# EAGLE design MCU_Board - Rev A2 (EAGLE 7.7.0)

## Sheet 1 of 2
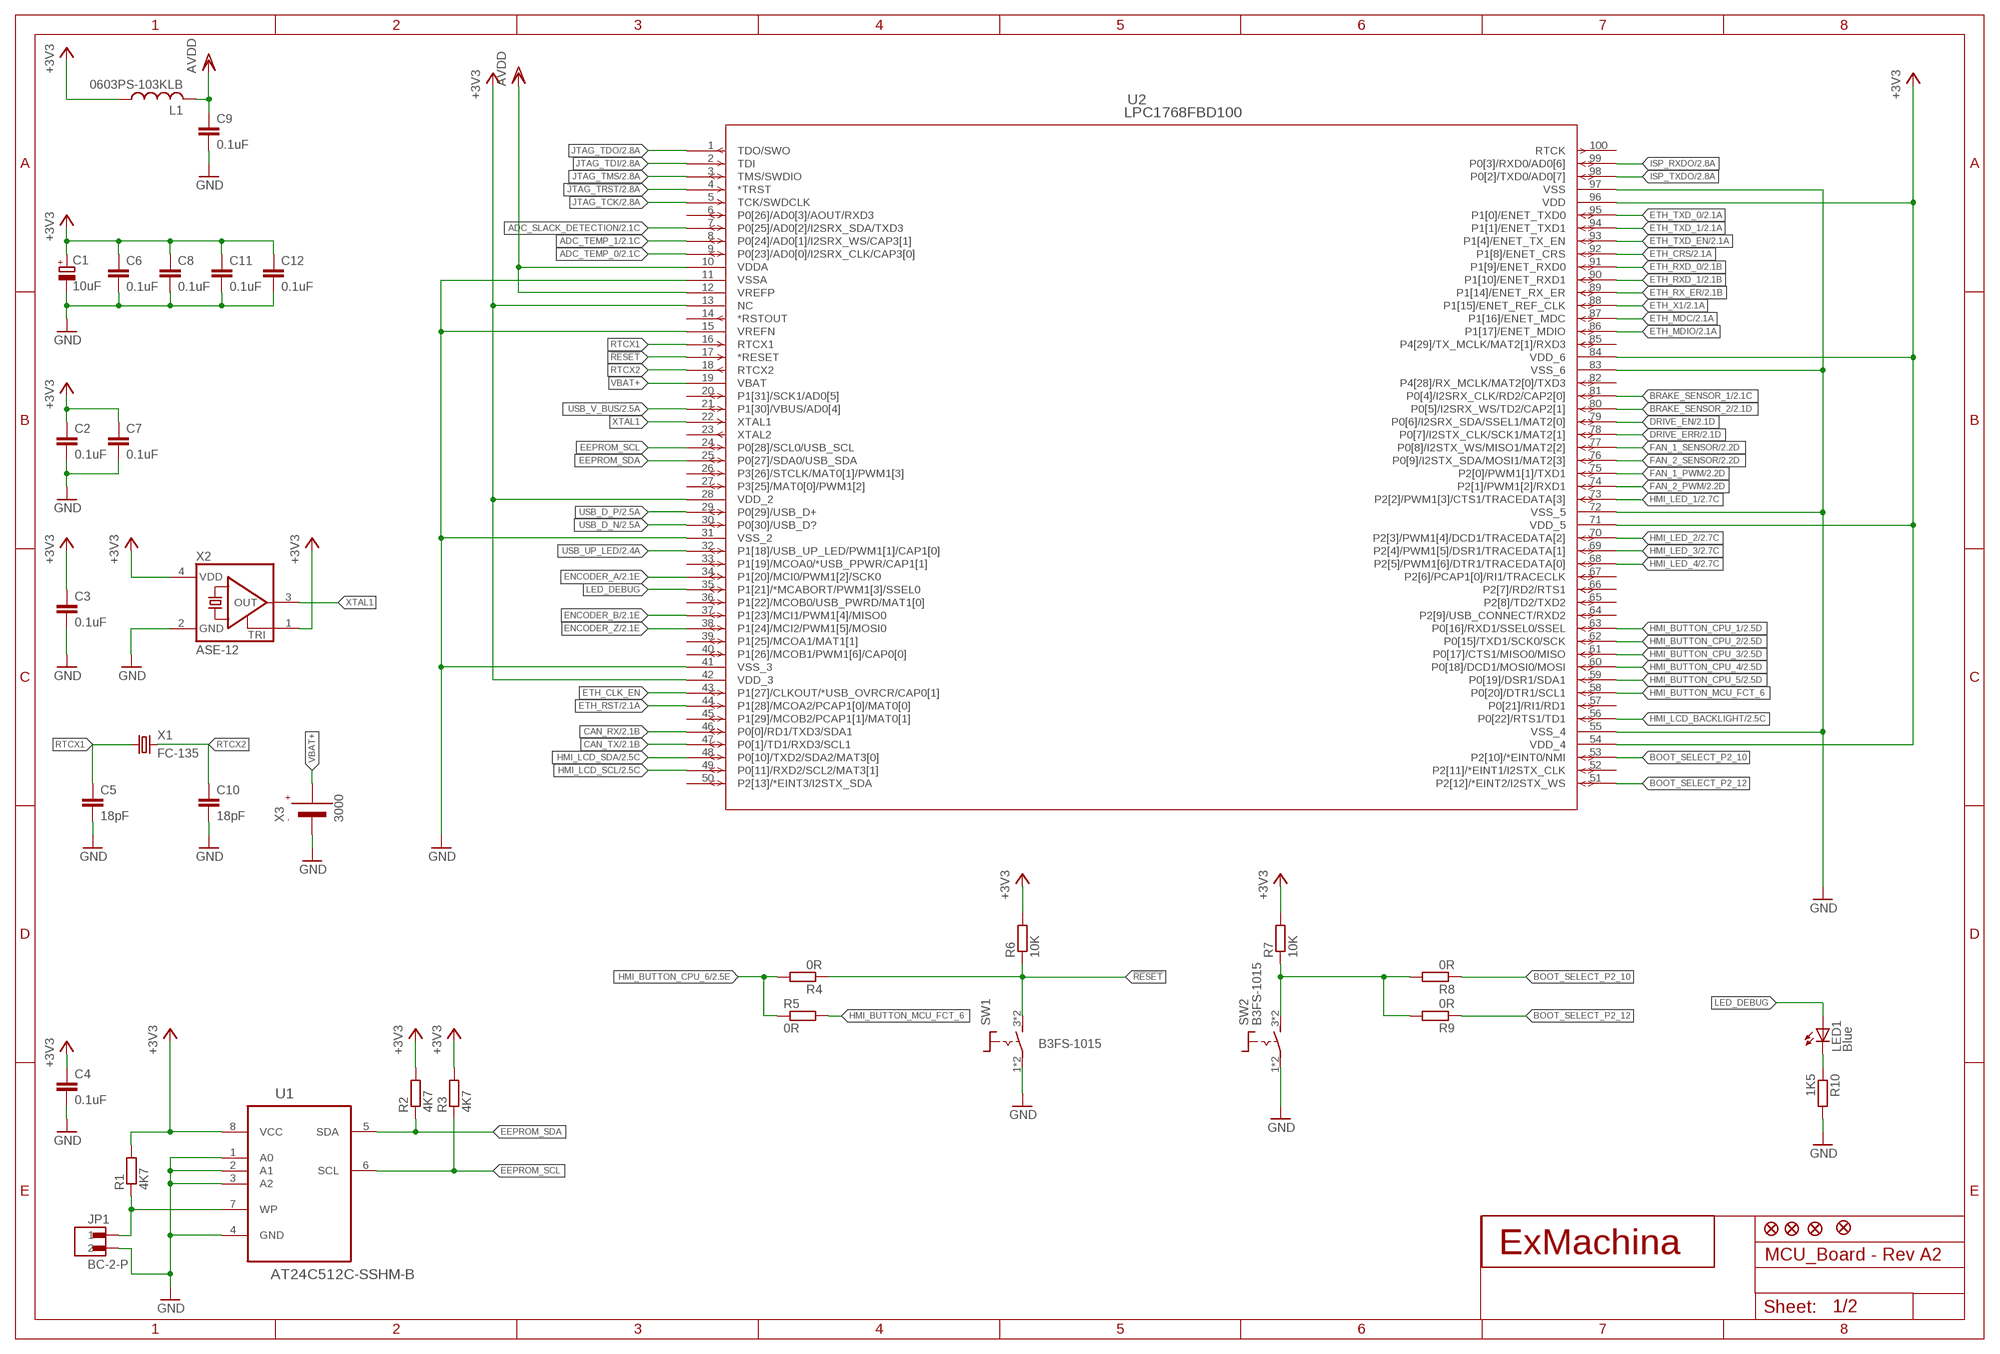
[diagram p0: schematic, sheet 1]

### Parts
C1  10uF  CPOL-EUCT3216  [CT3216]
C2  0.1uF  C-EUC0603  [C0603]
C3  0.1uF  C-EUC0603  [C0603]
C4  0.1uF  C-EUC0603  [C0603]
C5  18pF  C-EUC0603  [C0603]
C6  0.1uF  C-EUC0603  [C0603]
C7  0.1uF  C-EUC0603  [C0603]
C8  0.1uF  C-EUC0603  [C0603]
C9  0.1uF  C-EUC0603  [C0603]
C10  18pF  C-EUC0603  [C0603]
C11  0.1uF  C-EUC0603  [C0603]
C12  0.1uF  C-EUC0603  [C0603]
JP1  BC-2-P  [BC-2-P]
JP2  FIDUCIAL1X2  [FIDUCIAL-1X2]
JP3  FIDUCIAL1X2  [FIDUCIAL-1X2]
JP4  FIDUCIAL1X2  [FIDUCIAL-1X2]
JP5  FIDUCIAL1X2  [FIDUCIAL-1X2]
L1  0603PS-103KLB  0603PS  [0603]
LED1  Blue  LEDCHIPLED_0603  [CHIPLED_0603]
R1  4K7  R-EU_R0603  [R0603]
R2  4K7  R-EU_R0603  [R0603]
R3  4K7  R-EU_R0603  [R0603]
R4  0R  R-EU_R0603  [R0603]
R5  0R  R-EU_R0603  [R0603]
R6  10K  R-EU_R0603  [R0603]
R7  10K  R-EU_R0603  [R0603]
R8  0R  R-EU_R0603  [R0603]
R9  0R  R-EU_R0603  [R0603]
R10  1K5  R-EU_R0603  [R0603]
SW1  B3FS-1015  [B3FS]
SW2  B3FS-1015  [B3FS]
T2  EXMACHINA-LOGO-NAME  [EXM-LOGO-BASELINE]
U1  AT24C512C-SSHM-B  [SOIC127P600X175-8N]
U2  LPC1768FBD100  [SOT407-1]
X1  FC-135  [FC-135]
X2  ASE-12  ASE  [ASE]
X3  3000  [3000]

### Nets
!JTAG_TRST: U2.4(*TRST) ; also sheet 2
!RESET: R4.1 R6.1 SW1.3 SW1.4 U2.17(*RESET)
+3V3 [supply]: C1.+ C2.1 C3.1 C4.1 C6.1 C7.1 C8.1 C11.1 C12.1 L1.P$1 R1.2 R2.2 R3.2 R6.2 R7.2 U1.8(VCC) U2.13(NC) U2.28(VDD_2) U2.42(VDD_3) U2.54(VDD_4) U2.71(VDD_5) U2.84(VDD_6) U2.96(VDD) X2.1(TRI) X2.4(VDD) ; also sheet 2
ADC_SLACK_DETECTION [signal]: U2.7(P0[25]/AD0[2]/I2SRX_SDA/TXD3) ; also sheet 2
ADC_TEMP_0 [signal]: U2.9(P0[23]/AD0[0]/I2SRX_CLK/CAP3[0]) ; also sheet 2
ADC_TEMP_1 [signal]: U2.8(P0[24]/AD0[1]/I2SRX_WS/CAP3[1]) ; also sheet 2
AVDD: C9.1 L1.P$2 U2.10(VDDA) U2.12(VREFP) ; also sheet 2
BOOT_SELECT_P2_10 [signal]: R8.1 U2.53(P2[10]/*EINT0/NMI)
BOOT_SELECT_P2_12 [signal]: R9.1 U2.51(P2[12]/*EINT2/I2STX_WS)
BRAKE_SENSOR_1: U2.81(P0[4]/I2SRX_CLK/RD2/CAP2[0]) ; also sheet 2
BRAKE_SENSOR_2: U2.80(P0[5]/I2SRX_WS/TD2/CAP2[1]) ; also sheet 2
CAN_RX [signal]: U2.46(P0[0]/RD1/TXD3/SDA1) ; also sheet 2
CAN_TX [signal]: U2.47(P0[1]/TD1/RXD3/SCL1) ; also sheet 2
DRIVE_EN: U2.79(P0[6]/I2SRX_SDA/SSEL1/MAT2[0]) ; also sheet 2
DRIVE_ERR: U2.78(P0[7]/I2STX_CLK/SCK1/MAT2[1]) ; also sheet 2
EEPROM_SCL: R3.1 U1.6(SCL) U2.24(P0[28]/SCL0/USB_SCL)
EEPROM_SDA: R2.1 U1.5(SDA) U2.25(P0[27]/SDA0/USB_SDA)
ENCODER_A: U2.34(P1[20]/MCI0/PWM1[2]/SCK0) ; also sheet 2
ENCODER_B: U2.37(P1[23]/MCI1/PWM1[4]/MISO0) ; also sheet 2
ENCODER_Z: U2.38(P1[24]/MCI2/PWM1[5]/MOSI0) ; also sheet 2
ETH_CLK_EN [signal]: U2.43(P1[27]/CLKOUT/*USB_OVRCR/CAP0[1])
ETH_CRS [signal]: U2.92(P1[8]/ENET_CRS) ; also sheet 2
ETH_MDC [signal]: U2.87(P1[16]/ENET_MDC) ; also sheet 2
ETH_MDIO [signal]: U2.86(P1[17]/ENET_MDIO) ; also sheet 2
ETH_RST: U2.44(P1[28]/MCOA2/PCAP1[0]/MAT0[0]) ; also sheet 2
ETH_RX_ER [signal]: U2.89(P1[14]/ENET_RX_ER) ; also sheet 2
ETH_RXD_0 [signal]: U2.91(P1[9]/ENET_RXD0) ; also sheet 2
ETH_RXD_1 [signal]: U2.90(P1[10]/ENET_RXD1) ; also sheet 2
ETH_TXD_0 [signal]: U2.95(P1[0]/ENET_TXD0) ; also sheet 2
ETH_TXD_1 [signal]: U2.94(P1[1]/ENET_TXD1) ; also sheet 2
ETH_TXD_EN [signal]: U2.93(P1[4]/ENET_TX_EN) ; also sheet 2
ETH_X1: U2.88(P1[15]/ENET_REF_CLK) ; also sheet 2
FAN_1_PWM [signal]: U2.75(P2[0]/PWM1[1]/TXD1) ; also sheet 2
FAN_1_SENSOR [signal]: U2.77(P0[8]/I2STX_WS/MISO1/MAT2[2]) ; also sheet 2
FAN_2_PWM [signal]: U2.74(P2[1]/PWM1[2]/RXD1) ; also sheet 2
FAN_2_SENSOR [signal]: U2.76(P0[9]/I2STX_SDA/MOSI1/MAT2[3]) ; also sheet 2
GND [supply]: C1.- C2.2 C3.2 C4.2 C5.2 C6.2 C7.2 C8.2 C9.2 C10.2 C11.2 C12.2 JP1.2 R10.2 SW1.1 SW1.2 SW2.1 SW2.2 U1.1(A0) U1.2(A1) U1.3(A2) U1.4(GND) U2.11(VSSA) U2.15(VREFN) U2.31(VSS_2) U2.41(VSS_3) U2.55(VSS_4) U2.72(VSS_5) U2.83(VSS_6) U2.97(VSS) X2.2(GND) X3.-(VBAT-) ; also sheet 2
HMI_BUTTON_CPU_1: U2.63(P0[16]/RXD1/SSEL0/SSEL) ; also sheet 2
HMI_BUTTON_CPU_2: U2.62(P0[15]/TXD1/SCK0/SCK) ; also sheet 2
HMI_BUTTON_CPU_3: U2.61(P0[17]/CTS1/MISO0/MISO) ; also sheet 2
HMI_BUTTON_CPU_4: U2.60(P0[18]/DCD1/MOSI0/MOSI) ; also sheet 2
HMI_BUTTON_CPU_5: U2.59(P0[19]/DSR1/SDA1) ; also sheet 2
HMI_BUTTON_CPU_6: R4.2 R5.1 ; also sheet 2
HMI_BUTTON_MCU_FCT_6: R5.2 U2.58(P0[20]/DTR1/SCL1)
HMI_LCD_BACKLIGHT: U2.56(P0[22]/RTS1/TD1) ; also sheet 2
HMI_LCD_SCL [signal]: U2.49(P0[11]/RXD2/SCL2/MAT3[1]) ; also sheet 2
HMI_LCD_SDA [signal]: U2.48(P0[10]/TXD2/SDA2/MAT3[0]) ; also sheet 2
HMI_LED_1 [signal]: U2.73(P2[2]/PWM1[3]/CTS1/TRACEDATA[3]) ; also sheet 2
HMI_LED_2 [signal]: U2.70(P2[3]/PWM1[4]/DCD1/TRACEDATA[2]) ; also sheet 2
HMI_LED_3 [signal]: U2.69(P2[4]/PWM1[5]/DSR1/TRACEDATA[1]) ; also sheet 2
HMI_LED_4 [signal]: U2.68(P2[5]/PWM1[6]/DTR1/TRACEDATA[0]) ; also sheet 2
ISP_RXDO [signal]: U2.99(P0[3]/RXD0/AD0[6]) ; also sheet 2
ISP_TXDO [signal]: U2.98(P0[2]/TXD0/AD0[7]) ; also sheet 2
JTAG_TCK [signal]: U2.5(TCK/SWDCLK) ; also sheet 2
JTAG_TDI [signal]: U2.2(TDI) ; also sheet 2
JTAG_TDO [signal]: U2.1(TDO/SWO) ; also sheet 2
JTAG_TMS [signal]: U2.3(TMS/SWDIO) ; also sheet 2
LED_DEBUG [signal]: LED1.A U2.35(P1[21]/*MCABORT/PWM1[3]/SSEL0)
N$5 [signal]: R7.1 R8.2 R9.2 SW2.3 SW2.4
N$22: JP1.1 R1.1 U1.7(WP)
N$29 [signal]: LED1.C R10.1
RTCX1: C5.1 U2.16(RTCX1) X1.1
RTCX2: C10.1 U2.18(RTCX2) X1.2
USB_D_N [signal]: U2.30(P0[30]/USB_D?) ; also sheet 2
USB_D_P [signal]: U2.29(P0[29]/USB_D+) ; also sheet 2
USB_UP_LED [signal]: U2.32(P1[18]/USB_UP_LED/PWM1[1]/CAP1[0]) ; also sheet 2
USB_V_BUS [signal]: U2.21(P1[30]/VBUS/AD0[4]) ; also sheet 2
VBAT+: U2.19(VBAT) X3.+1(VBAT+) X3.+2(VBAT+)
XTAL1: U2.22(XTAL1) X2.3(OUT)
Unconnected: U2.6(P0[26]/AD0[3]/AOUT/RXD3) U2.14(*RSTOUT) U2.20(P1[31]/SCK1/AD0[5]) U2.23(XTAL2) U2.26(P3[26]/STCLK/MAT0[1]/PWM1[3]) U2.27(P3[25]/MAT0[0]/PWM1[2]) U2.33(P1[19]/MCOA0/*USB_PPWR/CAP1[1]) U2.36(P1[22]/MCOB0/USB_PWRD/MAT1[0]) U2.39(P1[25]/MCOA1/MAT1[1]) U2.40(P1[26]/MCOB1/PWM1[6]/CAP0[0]) U2.45(P1[29]/MCOB2/PCAP1[1]/MAT0[1]) U2.50(P2[13]/*EINT3/I2STX_SDA) U2.52(P2[11]/*EINT1/I2STX_CLK) U2.57(P0[21]/RI1/RD1) U2.64(P2[9]/USB_CONNECT/RXD2) U2.65(P2[8]/TD2/TXD2) U2.66(P2[7]/RD2/RTS1) U2.67(P2[6]/PCAP1[0]/RI1/TRACECLK) U2.82(P4[28]/RX_MCLK/MAT2[0]/TXD3) U2.85(P4[29]/TX_MCLK/MAT2[1]/RXD3) U2.100(RTCK)

## Sheet 2 of 2
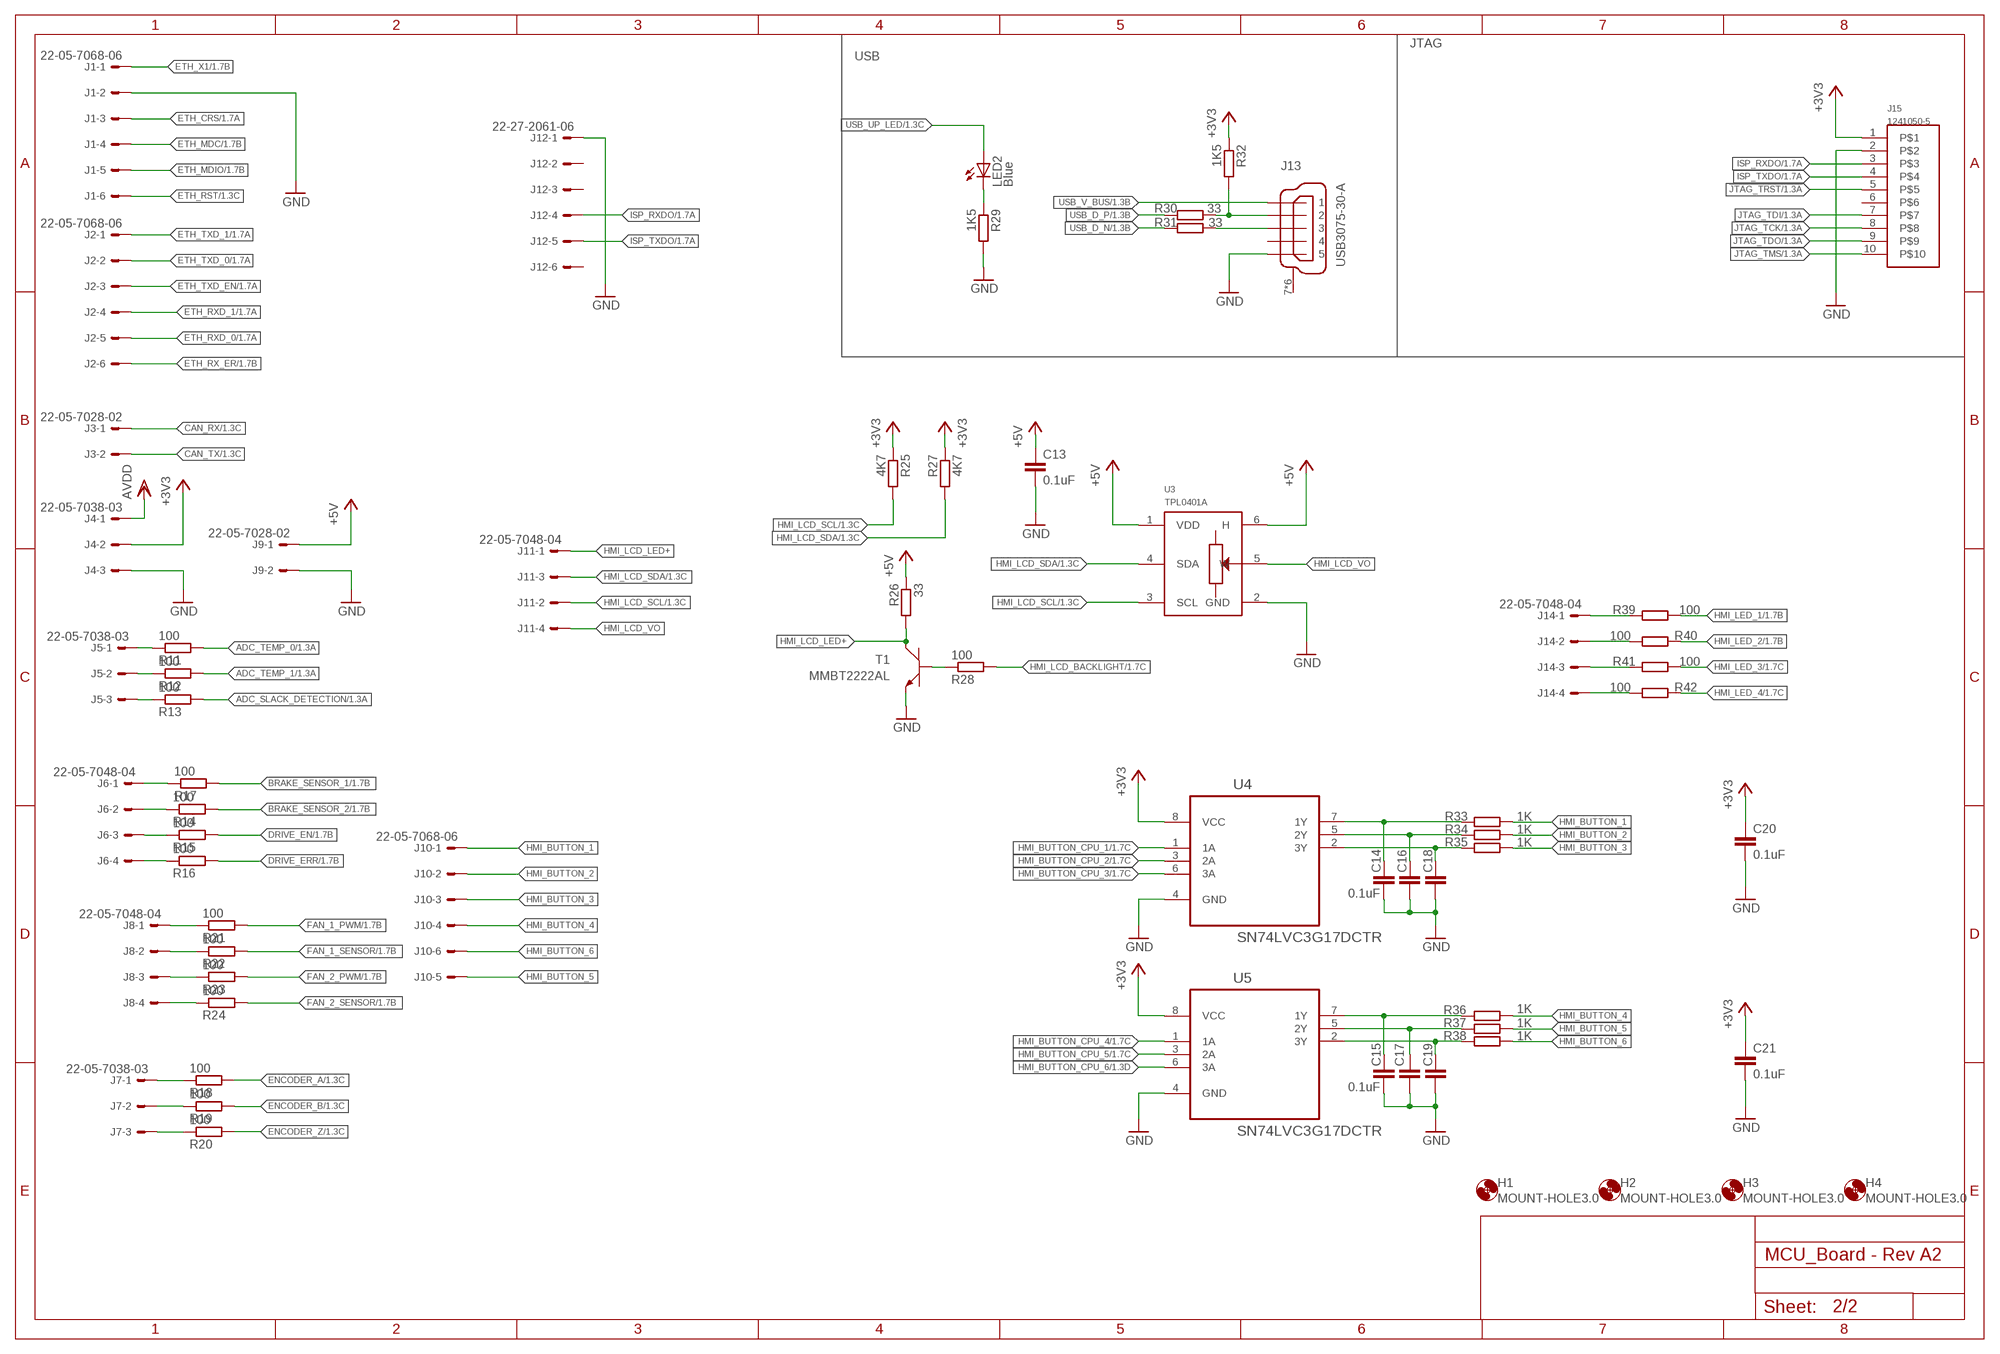
[diagram p1: schematic, sheet 2]

### Parts
C13  0.1uF  C-EUC0603  [C0603]
C14  0.1uF  C-EUC0603  [C0603]
C15  0.1uF  C-EUC0603  [C0603]
C16  0.1uF  C-EUC0603  [C0603]
C17  0.1uF  C-EUC0603  [C0603]
C18  0.1uF  C-EUC0603  [C0603]
C19  0.1uF  C-EUC0603  [C0603]
C20  0.1uF  C-EUC0603  [C0603]
C21  0.1uF  C-EUC0603  [C0603]
H1  MOUNT-HOLE3.0  [3,0]
H2  MOUNT-HOLE3.0  [3,0]
H3  MOUNT-HOLE3.0  [3,0]
H4  MOUNT-HOLE3.0  [3,0]
J1  22-05-7068-06  [7395-06]
J2  22-05-7068-06  [7395-06]
J3  22-05-7028-02  [7395-02]
J4  22-05-7038-03  [7395-03]
J5  22-05-7038-03  [7395-03]
J6  22-05-7048-04  [7395-04]
J7  22-05-7038-03  [7395-03]
J8  22-05-7048-04  [7395-04]
J9  22-05-7028-02  [7395-02]
J10  22-05-7068-06  [7395-06]
J11  22-05-7048-04  [7395-04]
J12  22-27-2061-06  [6410-06]
J13  USB3075-30-A  [USB_MICROB_SMT]
J14  22-05-7048-04  [7395-04]
J15  1241050-5  [2.54/2X5]
LED2  Blue  LEDCHIPLED_0603  [CHIPLED_0603]
R11  100  R-EU_R0603  [R0603]
R12  100  R-EU_R0603  [R0603]
R13  100  R-EU_R0603  [R0603]
R14  100  R-EU_R0603  [R0603]
R15  100  R-EU_R0603  [R0603]
R16  100  R-EU_R0603  [R0603]
R17  100  R-EU_R0603  [R0603]
R18  100  R-EU_R0603  [R0603]
R19  100  R-EU_R0603  [R0603]
R20  100  R-EU_R0603  [R0603]
R21  100  R-EU_R0603  [R0603]
R22  100  R-EU_R0603  [R0603]
R23  100  R-EU_R0603  [R0603]
R24  100  R-EU_R0603  [R0603]
R25  4K7  R-EU_R0603  [R0603]
R26  33  R-EU_R0603  [R0603]
R27  4K7  R-EU_R0603  [R0603]
R28  100  R-EU_R0603  [R0603]
R29  1K5  R-EU_R0603  [R0603]
R30  33  R-EU_R0603  [R0603]
R31  33  R-EU_R0603  [R0603]
R32  1K5  R-EU_R0603  [R0603]
R33  1K  R-EU_R0603  [R0603]
R34  1K  R-EU_R0603  [R0603]
R35  1K  R-EU_R0603  [R0603]
R36  1K  R-EU_R0603  [R0603]
R37  1K  R-EU_R0603  [R0603]
R38  1K  R-EU_R0603  [R0603]
R39  100  R-EU_R0603  [R0603]
R40  100  R-EU_R0603  [R0603]
R41  100  R-EU_R0603  [R0603]
R42  100  R-EU_R0603  [R0603]
T1  MMBT2222AL  [SOT−23]
U3  TPL0401A  [SC-70-DCK]
U4  SN74LVC3G17DCTR  [SOP65P400X130-8N]
U5  SN74LVC3G17DCTR  [SOP65P400X130-8N]

### Nets
!JTAG_TRST: J15.5 ; also sheet 1
+3V3 [supply]: C20.1 C21.1 J4.2 J15.1 R25.1 R27.1 R32.1 U4.8(VCC) U5.8(VCC) ; also sheet 1
+5V [supply]: C13.1 J9.1 R26.1 U3.1(VDD) U3.6(H)
ADC_SLACK_DETECTION [signal]: R13.2 ; also sheet 1
ADC_TEMP_0 [signal]: R11.2 ; also sheet 1
ADC_TEMP_1 [signal]: R12.2 ; also sheet 1
AVDD: J4.1 ; also sheet 1
BRAKE_SENSOR_1: R17.2 ; also sheet 1
BRAKE_SENSOR_2: R14.2 ; also sheet 1
CAN_RX [signal]: J3.1 ; also sheet 1
CAN_TX [signal]: J3.2 ; also sheet 1
DRIVE_EN: R15.2 ; also sheet 1
DRIVE_ERR: R16.2 ; also sheet 1
ENCODER_A: R18.2 ; also sheet 1
ENCODER_B: R19.2 ; also sheet 1
ENCODER_Z: R20.2 ; also sheet 1
ETH_CRS [signal]: J1.3 ; also sheet 1
ETH_MDC [signal]: J1.4 ; also sheet 1
ETH_MDIO [signal]: J1.5 ; also sheet 1
ETH_RST: J1.6 ; also sheet 1
ETH_RX_ER [signal]: J2.6 ; also sheet 1
ETH_RXD_0 [signal]: J2.5 ; also sheet 1
ETH_RXD_1 [signal]: J2.4 ; also sheet 1
ETH_TXD_0 [signal]: J2.2 ; also sheet 1
ETH_TXD_1 [signal]: J2.1 ; also sheet 1
ETH_TXD_EN [signal]: J2.3 ; also sheet 1
ETH_X1: J1.1 ; also sheet 1
FAN_1_PWM [signal]: R21.2 ; also sheet 1
FAN_1_SENSOR [signal]: R22.2 ; also sheet 1
FAN_2_PWM [signal]: R23.2 ; also sheet 1
FAN_2_SENSOR [signal]: R24.2 ; also sheet 1
GND [supply]: C13.2 C14.2 C15.2 C16.2 C17.2 C18.2 C19.2 C20.2 C21.2 J1.2 J4.3 J9.2 J12.1 J13.5 J15.2 R29.2 T1.2(E) U3.2(GND) U4.4(GND) U5.4(GND) ; also sheet 1
HMI_BUTTON_1 [signal]: J10.1 R33.1
HMI_BUTTON_2 [signal]: J10.2 R34.1
HMI_BUTTON_3 [signal]: J10.3 R35.1
HMI_BUTTON_4 [signal]: J10.4 R36.1
HMI_BUTTON_5 [signal]: J10.5 R37.1
HMI_BUTTON_6: J10.6 R38.1
HMI_BUTTON_CPU_1: U4.1(1A) ; also sheet 1
HMI_BUTTON_CPU_2: U4.3(2A) ; also sheet 1
HMI_BUTTON_CPU_3: U4.6(3A) ; also sheet 1
HMI_BUTTON_CPU_4: U5.1(1A) ; also sheet 1
HMI_BUTTON_CPU_5: U5.3(2A) ; also sheet 1
HMI_BUTTON_CPU_6: U5.6(3A) ; also sheet 1
HMI_LCD_BACKLIGHT: R28.2 ; also sheet 1
HMI_LCD_LED+: J11.1 R26.2 T1.3(C)
HMI_LCD_SCL [signal]: J11.2 R25.2 U3.3(SCL) ; also sheet 1
HMI_LCD_SDA [signal]: J11.3 R27.2 U3.4(SDA) ; also sheet 1
HMI_LCD_VO: J11.4 U3.5(W)
HMI_LED_1 [signal]: R39.1 ; also sheet 1
HMI_LED_2 [signal]: R40.2 ; also sheet 1
HMI_LED_3 [signal]: R41.1 ; also sheet 1
HMI_LED_4 [signal]: R42.2 ; also sheet 1
ISP_RXDO [signal]: J12.4 J15.3 ; also sheet 1
ISP_TXDO [signal]: J12.5 J15.4 ; also sheet 1
JTAG_TCK [signal]: J15.8 ; also sheet 1
JTAG_TDI [signal]: J15.7 ; also sheet 1
JTAG_TDO [signal]: J15.9 ; also sheet 1
JTAG_TMS [signal]: J15.10 ; also sheet 1
N$1: J14.2 R40.1
N$2: J14.4 R42.1
N$3: J7.1 R18.1
N$4: J7.2 R19.1
N$6: J7.3 R20.1
N$7: R28.1 T1.1(B)
N$8: J8.1 R21.1
N$9: J8.2 R22.1
N$10: J8.3 R23.1
N$11: J8.4 R24.1
N$12: J5.3 R13.1
N$13: J5.2 R12.1
N$14: J5.1 R11.1
N$15 [signal]: J13.2 R30.1 R32.2
N$16 [signal]: J13.3 R31.1
N$17: C14.1 R33.2 U4.7(1Y)
N$18 [signal]: LED2.C R29.1
N$19: C16.1 R34.2 U4.5(2Y)
N$20: C18.1 R35.2 U4.2(3Y)
N$21: J6.4 R16.1
N$23: J6.3 R15.1
N$24: J6.2 R14.1
N$25: C15.1 R36.2 U5.7(1Y)
N$26: C17.1 R37.2 U5.5(2Y)
N$27: C19.1 R38.2 U5.2(3Y)
N$28: J6.1 R17.1
N$63: J14.1 R39.2
N$64: J14.3 R41.2
USB_D_N [signal]: R31.2 ; also sheet 1
USB_D_P [signal]: R30.2 ; also sheet 1
USB_UP_LED [signal]: LED2.A ; also sheet 1
USB_V_BUS [signal]: J13.1 ; also sheet 1
Unconnected: J12.2 J12.3 J12.6 J13.4 J13.7(S) J13.8(S) J13.9(S) J13.10(S) J13.11(S) J13.12(S) J15.6

### Notes on the sheet
- JTAG
- USB

## Library data of the parts
C1 = rcl:CPOL-EU: POLARIZED CAPACITOR, European symbol; MPN: F931A106MAA; OC_NEWARK: 58R3260
C2-C4 C6-C9 C11-C21 = rcl:C-EU: CAPACITOR, European symbol; MPN: MC0603B104K160CT; OC_NEWARK: 06R4923
C5 C10 = rcl:C-EU: CAPACITOR, European symbol; MPN: MC0603N180K500CT; OC_NEWARK: 06R5140
H1-H4 = holes:MOUNT-HOLE: MOUNTING HOLE with drill center marker; OC_NEWARK: unknown
J1 J2 J10 = con-molex:22-?-06: CONNECTOR wire to board 2.54 mm (.1 inch) pitch header; MPN: 22-05-7068; OC_FARNELL: unknown; OC_NEWARK: 25M1733
J3 J9 = con-molex:22-?-02: CONNECTOR wire to board 2.54 mm (.1 inch) pitch header; MPN: 22-05-7028; OC_FARNELL: 9731601; OC_NEWARK: 25M1728
J4 J5 J7 = con-molex:22-?-03: CONNECTOR wire to board 2.54 mm (.1 inch) pitch header; MPN: 22-05-7038; OC_FARNELL: 9731610; OC_NEWARK: 26M6362
J6 J8 J11 J14 = con-molex:22-?-04: CONNECTOR wire to board 2.54 mm (.1 inch) pitch header; MPN: 22-05-7048; OC_FARNELL: unknown; OC_NEWARK: 26M6363
J12 = con-molex:22-?-06: CONNECTOR wire to board 2.54 mm (.1 inch) pitch header; MF: MOLEX; MPN: 22-27-2061; OC_FARNELL: unknown; OC_NEWARK: 56H0719
J13 = con-GlobalConnectorTechnology:USB3075-30-A; MPN: USB3075-30-A; OC_NEWARK: 58T0863
J15 = con-amp:1241050-5; MPN: 1241050-5; OC_NEWARK: 98K5467
JP1 = exmachina:BC-2?; OC_NEWARK: unknown
JP2-JP5 = SparkFun:FIDUCIAL: Fiducial Alignment Points Various fiducial points for machine vision alignment.; OC_NEWARK: unknown
L1 = coilcraft:0603PS; OC_NEWARK: unknown
LED1 LED2 = led:LED: LED OSRAM: - CHIPLED LG R971, LG N971, LY N971, LG Q971, LY Q971, LO R971, LY R971 LH N974, LH R974 LS Q976, LO Q976, LY Q976 LO Q996 - Hyper CHIPLED LW Q18S LB Q993, LB Q99A, LB R99A - SideLED LS A670, LO A670, LY A670, LG A670, LP A670 LB A673, LV A673, LT A673, LW A673 LH A674 LY A675 LS A676, LA A676, LO A676, LY A676, LW A676 LS A679, LY A679, LG A679 - Hyper Micro SIDELED® LS Y876, LA Y876, LO Y876, LY Y876 LT Y87S - SmartLED LW L88C, LW L88S LB L89C, LB L89S, LG L890 LS L89K, LO L89K, LY L89K LS L896, LA L896, LO L896, LY L896 - TOPLED LS T670, LO T670, LY T670, LG T670, LP T670 LSG T670, LSP T670, LSY T670, LOP T670, LYG T670 LG T671, LOG T671, LSG T671 LB T673, LV T673, LT T673, LW T673 LH T674 LS T676, LA T676, LO T676, LY T676, LB T676, LH T676, LSB T676, LW T676 LB T67C, LV T67C, LT T67C, LS T67K, LO T67K, LY T67K, LW E67C LS E67B, LA E67B, LO E67B, LY E67B, LB E67C, LV E67C, LT E67C LW T67C LS T679, LY T679, LG T679 LS T770, LO T770, LY T770, LG T770, LP T770 LB T773, LV T773, LT T773, LW T773 LH T774 LS E675, LA E675, LY E675, LS T675 LS T776, LA T776, LO T776, LY T776, LB T776 LHGB T686 LT T68C, LB T68C - Hyper Mini TOPLED® LB M676 - Mini TOPLED Santana® LG M470 LS M47K, LO M47K, LY M47K Source: http://www.osram.convergy.de LUXEON: - LUMILED® LXK2-PW12-R00, LXK2-PW12-S00, LXK2-PW14-U00, LXK2-PW14-V00 LXK2-PM12-R00, LXK2-PM12-S00, LXK2-PM14-U00 LXK2-PE12-Q00, LXK2-PE12-R00, LXK2-PE12-S00, LXK2-PE14-T00, LXK2-PE14-U00 LXK2-PB12-K00, LXK2-PB12-L00, LXK2-PB12-M00, LXK2-PB14-N00, LXK2-PB14-P00, LXK2-PB14-Q00 LXK2-PR12-L00, LXK2-PR12-M00, LXK2-PR14-Q00, LXK2-PR14-R00 LXK2-PD12-Q00, LXK2-PD12-R00, LXK2-PD12-S00 LXK2-PH12-R00, LXK2-PH12-S00 LXK2-PL12-P00, LXK2-PL12-Q00, LXK2-PL12-R00 Source: www.luxeon.com KINGBRIGHT: KA-3528ASYC Source: www.kingbright.com; MPN: OVS-0603; OC_NEWARK: 15R2205
R1-R3 R25 R27 = rcl:R-EU_: RESISTOR, European symbol; MPN: MCMR06X4701FTL; OC_NEWARK: 86T3649
R4 R5 R8 R9 = rcl:R-EU_: RESISTOR, European symbol; MPN: MCMR06X000 PTL; OC_NEWARK: 86T3500
R6 R7 = rcl:R-EU_: RESISTOR, European symbol; MPN: MCMR06X1002FTL; OC_NEWARK: 86T3506
R10 R29 R32 = rcl:R-EU_: RESISTOR, European symbol; MPN: MCMR06X1501FTL; OC_NEWARK: 86T3542
R11-R24 R28 R39-R42 = rcl:R-EU_: RESISTOR, European symbol; MPN: MCMR06X1000FTL; OC_NEWARK: 86T3504
R26 R30 R31 = rcl:R-EU_: RESISTOR, European symbol; MPN: MCMR06X33R0FTL; OC_NEWARK: 86T3614
R33-R38 = rcl:R-EU_: RESISTOR, European symbol; MPN: MCMR06X1001FTL; OC_NEWARK: 86T3505
SW1 SW2 = Switch_SMT:B3FS: Surface-mounting Switches Ideal for High-density Mounting; OC_NEWARK: unknown
T1 = transistor:MMBT2222AL: General Purpose Transistors; MF: ON SEMICONDUCTOR; MPN: MMBT2222ALT1G; OC_NEWARK: 84K8795
T2 = exmachina:EXMACHINA-LOGO; OC_NEWARK: unknown
U1 = atmel:AT24C512C-SSHM-B: SERIAL EEPROM IC Memory Size:512Kbit,8-SOIC; MPN: AT24C02C-SSHM-B; OC_FARNELL: 1971995; OC_NEWARK: 68T4066; PACKAGE: 8SOIC; SUPPLIER: ATMEL
U2 = NXP:LPC1768FBD100; COPYRIGHT: Copyright C 2015 Accelerated Designs. All rights reserved; MANUFACTURER_PART_NUMBER: lpc1768fbd100; MPN: LPC1768FBD100; OC_NEWARK: 15R1840; VENDOR: NXP
U3 = ti:TPL0401; MPN: ISL90728WIE627Z-TK; OC_NEWARK: 65T7357
U4 U5 = ti:SN74LVC3G17DCTR: TRIPLE SCHMITT-TRIGGER BUFFER; MF: TEXAS INSTRUMENTS; MPN: SN74LVC3G17DCTR; OC_FARNELL: 1236391; OC_NEWARK: 90H3713; PACKAGE: SSOP-8; SUPPLIER: Texas Instruments
X1 = crystal:FC-135: 32.768kHz ±20ppm Crystal 12.5pF 70 kOhm -40°C ~ 85°C Surface Mount 2-SMD; MPN: Q13FC13500004; OC_NEWARK: 31M4970
X2 = crystal:ASE: 3.3Vdc CMOS SMD CRYSTAL CLOCK OSCILLATOR SOurce: www.abracon.com; MPN: ASE-12.000MHZ-LC-T; OC_FARNELL: unknown; OC_NEWARK: 40Y2118
X3 = keystone:3000; MF: KEYSTONE ELECTR; MPN: 3000; OC_NEWARK: 66F5622

## Net classes
1 signal: width 0.178 mm, drill 0.35 mm
2 supply: width 0.008 mm, drill 0.5 mm

## Board
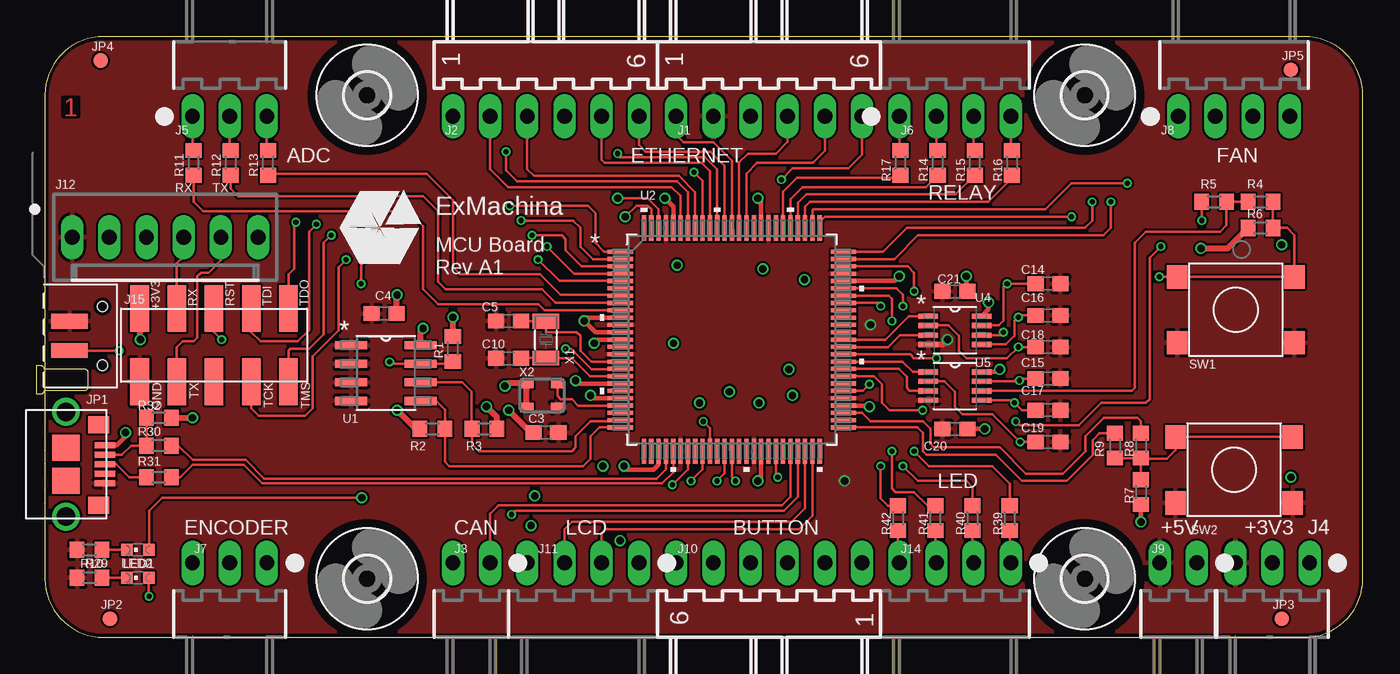
[diagram p2: board, top side]
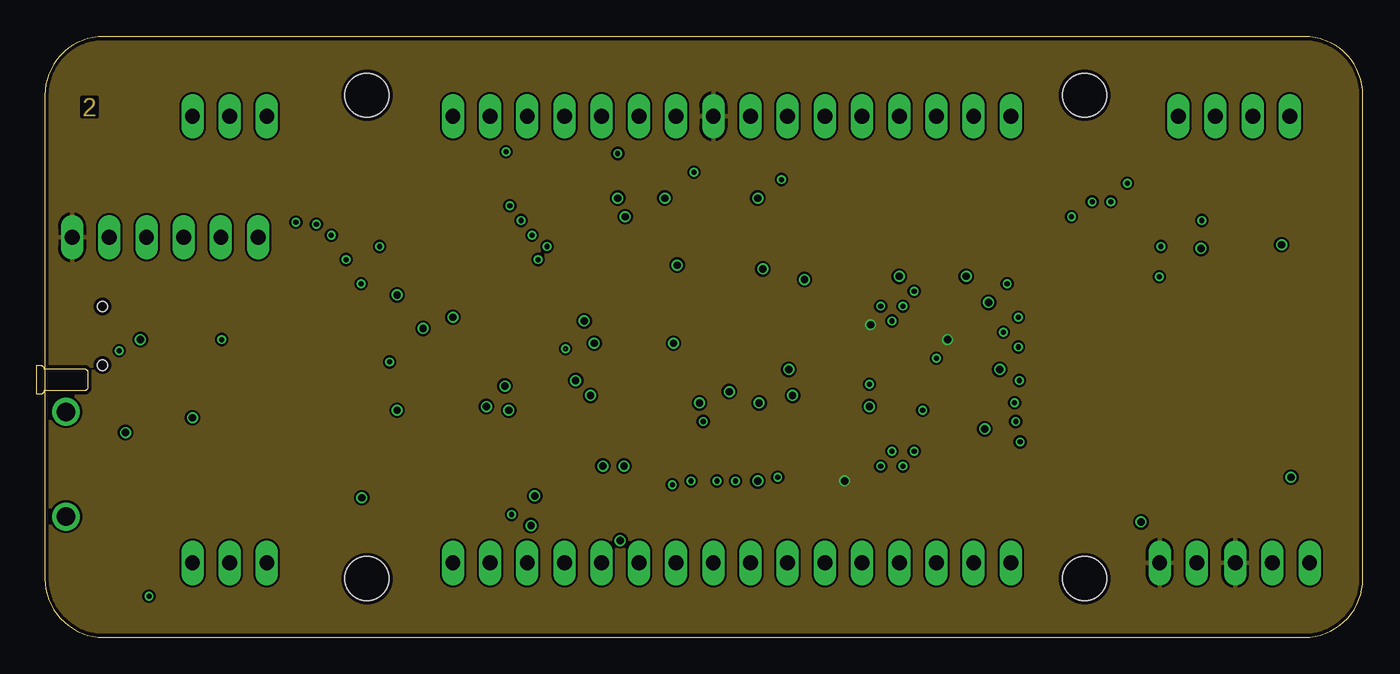
[diagram p3: board, inner layer Route2]
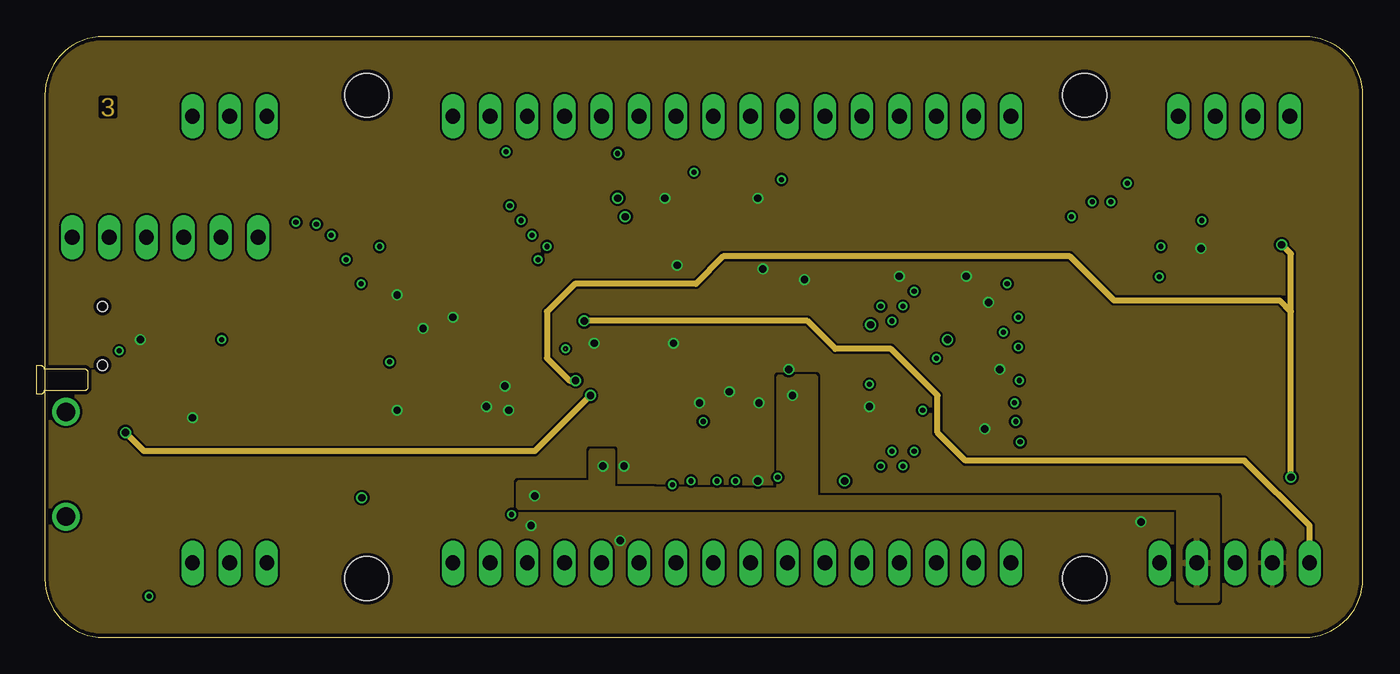
[diagram p4: board, inner layer Route15]
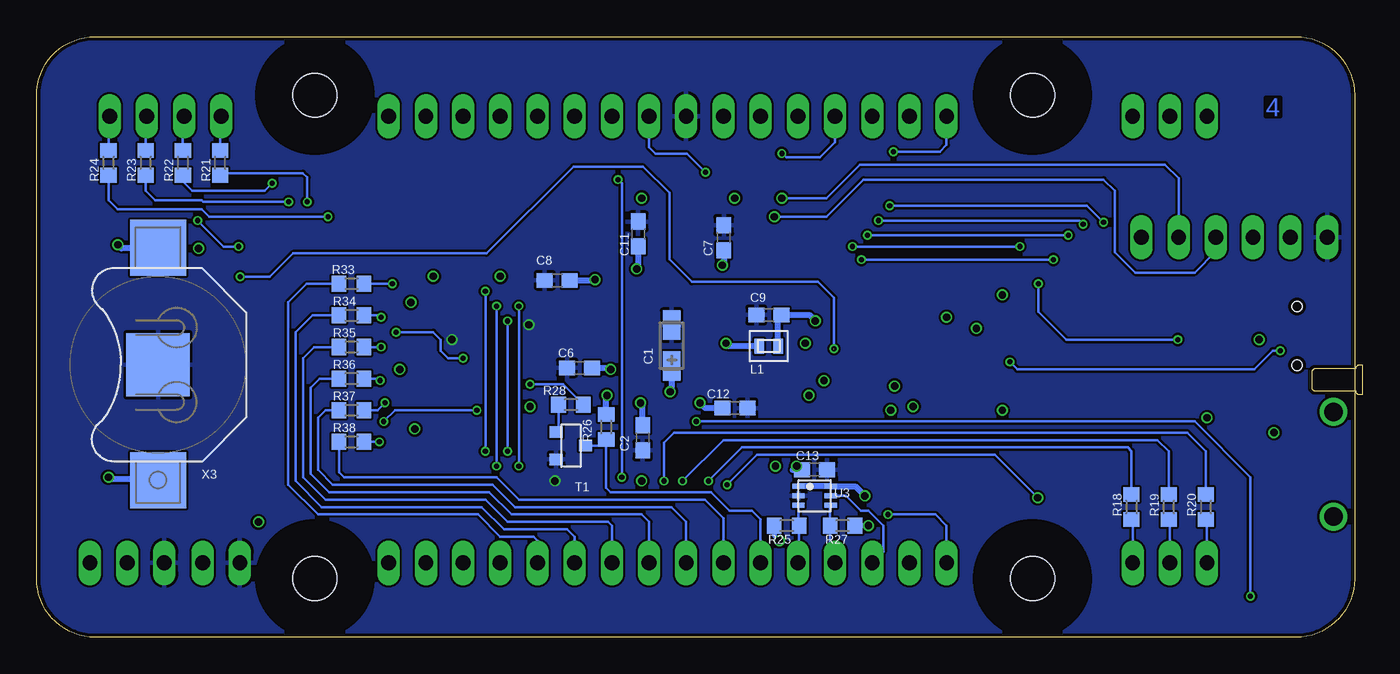
[diagram p5: board, bottom side, seen from below]

Size 90 x 41 mm. Coordinates in mm from the lower left corner, seen from the top.
Outline: 86,41 4,41 arc90 0,37 0,4 arc90 4,0 86,0 arc90 90,4 90,37 arc90 86,41
Copper layers (1+2*15+16): Top 0.018mm / dielectric 0.36mm / Route2 0.035mm / dielectric 0.71mm / Route15 0.035mm / dielectric 0.2mm / Bottom 0.018mm
Design rules "eC_4Layer_PClass6_BaseCopperO18-I35_eCDefault *": minimum track width 0.15mm, minimum drill 0.35mm, track to track 0.15mm, track to pad 0.15mm, pad to pad 0.15mm, via to via 0.15mm, smd to smd 0mil, copper to edge 0.25mm, drill to drill 0.35mm, minimum pad ring 0.175mm, minimum via ring 0.125mm, stop-mask expansion 0mil, vias tented up to drill 0.45mm, thermal gap 0.2mm

### Footprints (pad centres in the part's own frame; a part is rotated, then mirrored left to right if it is on the bottom)
CT3216 = smd 2 x 1.2: + -1.4,0; - 1.4,0
C0603 = smd 1.1 x 1: 1 -0.85,0; 2 0.85,0
3,0 = hole 3: 0,0
7395-06 = drill 1.016 long: 1 6.35,0; 2 3.81,0; 3 1.27,0; 4 -1.27,0; 5 -3.81,0; 6 -6.35,0
7395-02 = drill 1.016 long: 1 1.27,0; 2 -1.27,0
7395-03 = drill 1.016 long: 1 2.54,0; 2 0,0; 3 -2.54,0
7395-04 = drill 1.016 long: 1 3.81,0; 2 1.27,0; 3 -1.27,0; 4 -3.81,0
6410-06 = drill 1.016 long: 1 6.35,0; 2 3.81,0; 3 1.27,0; 4 -1.27,0; 5 -3.81,0; 6 -6.35,0
USB_MICROB_SMT = smd 0.4 x 1.4: 1 -1.3,2.65; 2 -0.65,2.65; 3 0,2.65; 4 0.65,2.65; 5 1.3,2.65 | smd 1.15 x 1.45: 7 -2.7,2.23; 8 2.8,2.23 | smd 1.75 x 1.9: 9 -1.125,0; 10 1.125,0 | drill 1.25 pad 1.9: 11 -3.575,0; 12 3.575,0
2.54/2X5 = smd 1.27 x 3.2: 1 -5.08,2.5; 2 -5.08,-2.5; 3 -2.54,2.5; 4 -2.54,-2.5; 5 0,2.5; 6 0,-2.5; 7 2.54,2.5; 8 2.54,-2.5; 9 5.08,2.5; 10 5.08,-2.5
BC-2-P = smd 1 x 2.5: 1 -1,-0.75; 2 1,-0.75 | hole 0.7: -2,-3; 2,-3
FIDUCIAL-1X2 = smd 1 x 1: 1 0,0
0603 = smd 0.64 x 1.02: P$1 -0.64,0; P$2 0.64,0
CHIPLED_0603 = smd 0.8 x 0.8: A 0,-0.75; C 0,0.75
R0603 = smd 1 x 1.1: 1 -0.85,0; 2 0.85,0
B3FS = smd 1.4 x 1.6: 1 4,-2.25; 2 -4,-2.25; 3 4,2.25; 4 -4,2.25
SOT−23 = smd 0.787 x 0.889: 1 0.94,1.003; 2 -0.94,1.003; 3 0,-1.003
SOIC127P600X175-8N = smd 2.184 x 0.559: 1 -2.362,1.905; 2 -2.362,0.635; 3 -2.362,-0.635; 4 -2.362,-1.905; 5 2.362,-1.905; 6 2.362,-0.635; 7 2.362,0.635; 8 2.362,1.905
SOT407-1 = smd 1.727 x 0.279: 1 -7.62,6; 2 -7.62,5.5; 3 -7.62,5; 4 -7.62,4.5; 5 -7.62,4; 6 -7.62,3.5; 7 -7.62,3; 8 -7.62,2.5; 9 -7.62,2; 10 -7.62,1.5; 11 -7.62,1; 12 -7.62,0.5; 13 -7.62,0; 14 -7.62,-0.5; 15 -7.62,-1; 16 -7.62,-1.5; 17 -7.62,-2; 18 -7.62,-2.5; 19 -7.62,-3; 20 -7.62,-3.5; 21 -7.62,-4; 22 -7.62,-4.5; 23 -7.62,-5; 24 -7.62,-5.5; 25 -7.62,-6; 51 7.62,-6; 52 7.62,-5.5; 53 7.62,-5; 54 7.62,-4.5; 55 7.62,-4; 56 7.62,-3.5; 57 7.62,-3; 58 7.62,-2.5; 59 7.62,-2; 60 7.62,-1.5; 61 7.62,-1; 62 7.62,-0.5; 63 7.62,0; 64 7.62,0.5; 65 7.62,1; 66 7.62,1.5; 67 7.62,2; 68 7.62,2.5; 69 7.62,3; 70 7.62,3.5; 71 7.62,4; 72 7.62,4.5; 73 7.62,5; 74 7.62,5.5; 75 7.62,6 | smd 0.279 x 1.727: 26 -6,-7.62; 27 -5.5,-7.62; 28 -5,-7.62; 29 -4.5,-7.62; 30 -4,-7.62; 31 -3.5,-7.62; 32 -3,-7.62; 33 -2.5,-7.62; 34 -2,-7.62; 35 -1.5,-7.62; 36 -1,-7.62; 37 -0.5,-7.62; 38 0,-7.62; 39 0.5,-7.62; 40 1,-7.62; 41 1.5,-7.62; 42 2,-7.62; 43 2.5,-7.62; 44 3,-7.62; 45 3.5,-7.62; 46 4,-7.62; 47 4.5,-7.62; 48 5,-7.62; 49 5.5,-7.62; 50 6,-7.62; 76 6,7.62; 77 5.5,7.62; 78 5,7.62; 79 4.5,7.62; 80 4,7.62; 81 3.5,7.62; 82 3,7.62; 83 2.5,7.62; 84 2,7.62; 85 1.5,7.62; 86 1,7.62; 87 0.5,7.62; 88 0,7.62; 89 -0.5,7.62; 90 -1,7.62; 91 -1.5,7.62; 92 -2,7.62; 93 -2.5,7.62; 94 -3,7.62; 95 -3.5,7.62; 96 -4,7.62; 97 -4.5,7.62; 98 -5,7.62; 99 -5.5,7.62; 100 -6,7.62
SC-70-DCK = smd 0.35 x 0.85: 1 -0.65,-1.1; 2 0,-1.1; 3 0.65,-1.1; 4 0.65,1.1; 5 0,1.1; 6 -0.65,1.1
SOP65P400X130-8N = smd 1.321 x 0.356: 1 -1.829,0.965; 2 -1.829,0.33; 3 -1.829,-0.33; 4 -1.829,-0.965; 5 1.829,-0.965; 6 1.829,-0.33; 7 1.829,0.33; 8 1.829,0.965
FC-135 = smd 1 x 1.8: 1 -1.25,0; 2 1.25,0
ASE = smd 0.9 x 0.65: 1 -1.05,-0.825; 2 1.05,-0.825; 3 1.05,0.825; 4 -1.05,0.825
3000 = smd 3.81 x 3.81: +1 -7.874,0; +2 8.001,0 | smd 4.318 x 4.318: - 0,0

### Placement (x,y rotation side)
C1  46.63,19.91 90 bottom
C2  48.62,13.62 270 bottom
C3  34.21,13.97 0 top
C4  23.16,22.1 180 top
C5  31.67,21.59 180 top
C6  52.93,18.39 180 bottom
C7  43.08,27.28 90 bottom
C8  54.45,24.36 180 bottom
C9  40,22 180 bottom
C10  31.67,19.05 180 top
C11  48.92,27.53 90 bottom
C12  42.32,15.65 0 bottom
C13  36.88,11.43 0 bottom
C14  68.5,24.13 0 top
C15  68.5,17.65 0 top
C16  68.5,21.97 0 top
C17  68.5,15.49 0 top
C18  68.5,19.81 0 top
C19  68.5,13.34 0 top
C20  62.15,14.22 180 top
C21  62.15,23.62 180 top
H1  71,4 0 top
H2  71,37 0 top
H3  22,37 0 top
H4  22,4 0 top
J1  49.45,35.56 180 top
J2  34.21,35.56 180 top
J3  29.13,5.08 0 top
J4  83.82,5.08 0 top
J5  12.62,35.56 180 top
J6  62.15,35.56 180 top
J7  12.62,5.08 0 top
J8  81.2,35.56 180 top
J9  77.39,5.08 0 top
J10  49.45,5.08 0 top
J11  36.75,5.08 0 top
J12  8.21,27.3 180 top
J13  1.44,11.81 270 top
J14  62.15,5.08 0 top
J15  11.56,19.94 0 top
JP1  0.94,20.57 90 top
JP2  4.45,1.27 0 top
JP3  84.45,1.27 0 top
JP4  3.81,39.37 0 top
JP5  85.09,38.73 0 top
L1  40.01,19.88 0 bottom
LED1  6.35,4.06 90 top
LED2  6.35,5.97 90 top
R1  27.86,19.68 90 top
R2  26.46,14.22 180 top
R3  30.02,14.22 0 top
R4  83.01,29.72 180 top
R5  79.84,29.72 180 top
R6  83.01,27.94 180 top
R7  74.85,9.91 270 top
R8  74.85,13.08 270 top
R9  73.07,13.08 270 top
R10  3.05,4.06 180 top
R11  10.16,32.38 270 top
R12  12.7,32.38 270 top
R13  15.24,32.38 270 top
R14  60.96,32.38 270 top
R15  63.5,32.38 270 top
R16  66.04,32.38 270 top
R17  58.42,32.38 270 top
R18  15.24,8.89 90 bottom
R19  12.7,8.89 90 bottom
R20  10.16,8.89 90 bottom
R21  77.47,32.38 270 bottom
R22  80.01,32.38 270 bottom
R23  82.55,32.38 270 bottom
R24  85.09,32.38 270 bottom
R25  38.78,7.62 0 bottom
R26  51.1,14.35 270 bottom
R27  34.97,7.62 180 bottom
R28  53.51,15.88 0 bottom
R29  3.05,5.97 180 top
R30  7.79,13.08 0 top
R31  7.79,10.92 0 top
R32  7.79,14.99 180 top
R33  68.5,24.13 0 bottom
R34  68.5,21.97 0 bottom
R35  68.5,19.81 0 bottom
R36  68.5,17.65 0 bottom
R37  68.5,15.49 0 bottom
R38  68.5,13.34 0 bottom
R39  65.88,8.13 270 top
R40  63.34,8.13 90 top
R41  60.8,8.13 270 top
R42  58.26,8.13 90 top
SW1  81.33,22.35 0 top
SW2  81.2,11.43 0 top
T1  53.51,13.08 90 bottom
T2  22.86,27.94 0 top
U1  23.29,18.03 0 top
U2  46.91,20.32 0 top
U3  36.88,9.65 270 bottom
U4  62.15,20.95 0 top
U5  62.15,17.14 0 top
X1  34.21,20.32 270 top
X2  33.96,16.51 0 top
X3  81.71,18.59 90 bottom

### Tracks (layer width: path | path; a pad name or v marks a point on that pad's centre or on a via)
!JTAG_TRST  (via drill 0.35)
  Top 0.178: U2.4 36.14,24.82 v34.29,26.67 | v12.06,20.32 11.56,20.83 J15.5 | v22.86,26.67 21.59,25.4 v21.59,24.13
  Bottom 0.178: v34.29,26.67 v22.86,26.67 | v21.59,24.13 21.59,22.23 19.68,20.32 v12.06,20.32
!RESET  (via drill 0.35)  (1 unrouted)
  Top 0.178: R4.1 R6.1 84.84,27.94 85.33,27.45 SW1.3 SW1.4 v76.1,24.6 | U2.17 39.26,18.29 37.34,18.29 35.94,19.68 v35.56,19.68
  Bottom 0.178: v76.1,24.6 74.09,24.6 72.49,26.2 59.28,26.2 53.35,32.13 48.6,32.13 46.8,30.33 46.8,25.79 45.26,24.26 36.64,24.26 35.55,23.16 35.55,19.67
+3V3  (via drill 0.5)
  Top 0.305: U2.96 42.91,29.4 v42.34,29.97 | U2.84 48.91,29.75 v48.69,29.97 | U2.28 41.91,11.76 41.58,11.43 39.8,11.43 v39.54,11.68 | U2.42 48.91,10.89 v48.69,10.67 | R7.2 v74.85,7.87 | U5.8 65.02,18.11 v65.2,18.29 | U4.8 64.44,22.38 v64.44,22.86 | C21.1 62.91,23.71 v62.91,24.64 | C20.1 v64.18,14.22 | U2.71 58.02,24.32 v58.34,24.64 | U2.13 37.77,20.32 v37.51,20.07 | U2.54 56.24,15.82 v56.31,15.75
  Top 0.406: R3.2 30.87,15.03 v30.15,15.75 | C4.1 24.01,23.33 v24.05,23.37 | U1.8 25.65,20.9 v25.83,21.08 | R1.2 v27.86,21.84 | R32.1 v10.08,14.99 | v78.95,26.54 80.76,26.54 R6.2 | J15.1 6.48,20.37 v6.52,20.32 | v31.42,17.14 31.61,17.34 X2.4 X2.1 | C3.1 33.19,13.97 v31.67,15.49 | R2.2 25.32,14.22 v24.05,15.49
  Bottom 0.305: R25.1 39.63,6.95 v39.29,6.6 | R27.1 v33.19,7.62
  Bottom 0.406: L1.P$1 42.74,19.88 v42.93,20.07 | C12.1 44.35,15.65 v44.7,16 | C2.1 48.62,15.85 v48.77,16 | C6.1 50.9,18.39 v50.8,18.29 | C7.1 43.08,25.5 v43.18,25.4 | C11.1 48.92,25.25 v49.02,25.15 | C8.1 51.93,24.36 v51.87,24.42 | C1.+ 46.63,16.87 v46.74,16.76
  pour Route15 (rank 2): -12.78,48.26 109.14,48.26 109.14,-7.62 -12.78,-7.62
+5V  (via drill 0.5)
  Bottom 0.406: R26.1 51.1,16.46 v51.05,16.51 | C13.1 38.35,11.43 v38.1,11.68 | U3.1 U3.6 34.1,10.3 v33.45,9.65
  pour Route15: 77.47,2.54 77.47,8.89 32.38,8.89 32.38,10.54 37.34,10.54 37.34,12.7 38.73,12.7 38.73,10.16 50.16,10.03 50.16,17.78 52.58,17.78 52.58,9.53 80.01,9.53 80.01,2.54
ADC_SLACK_DETECTION
  Top 0.178: U2.7 39.24,23.37 35.23,23.37 33.83,24.77 28.37,24.77 27.86,25.27 27.86,29.84 26.08,31.62 15.33,31.62 R13.2
ADC_TEMP_0
  Top 0.178: U2.9 34.12,22.32 33.7,22.73 26.84,22.73 25.83,23.75 25.83,28.07 24.81,29.08 10.79,29.08 10.16,29.72 R11.2 10.16,31.11
ADC_TEMP_1
  Top 0.178: U2.8 34.88,22.82 33.96,23.75 27.35,23.75 26.84,24.26 26.84,29.08 25.83,30.1 13.21,30.1 12.7,30.61 R12.2
AVDD  (via drill 0.5)
  Top 0.305: U2.10 37.06,21.82 v36.83,21.59 37.6,20.82 U2.12
  Route15 0.406: J4.1 86.36,7.62 81.92,12.06 62.87,12.06 60.96,13.97 60.96,16.51 57.78,19.68 53.98,19.68 52.07,21.59 v36.83,21.59
  Bottom 0.406: v36.83,21.59 37.24,22 C9.1 39.37,21.78 L1.P$2
BOOT_SELECT_P2_10
  Top 0.178: R8.1 74.85,14.73 74.6,14.99 72.31,14.99 71.04,13.72 71.04,12.7 69.52,11.18 66.98,11.18 65.2,12.95 60.71,12.95 60.45,13.21 60.45,14.22 59.94,14.73 56.39,14.73 55.8,15.32 U2.53
BOOT_SELECT_P2_12
  Top 0.178: R9.1 72.02,13.93 71.55,13.46 71.55,12.45 69.77,10.67 66.72,10.67 64.94,12.45 60.2,12.45 59.94,12.7 59.94,13.97 59.59,14.32 U2.51
BRAKE_SENSOR_1
  Top 0.178: U2.81 50.41,30.42 51.35,31.37 58.25,31.37 R17.2
BRAKE_SENSOR_2
  Top 0.178: U2.80 50.91,29.91 51.74,30.73 60.16,30.73 R14.2
CAN_RX
  Top 0.178: U2.46 50.91,9.59 50.34,9.02 30.99,9.02 30.4,8.43 J3.1
CAN_TX  (via drill 0.35)
  Top 0.178: U2.47 51.41,9.58 50.47,8.64 32.13,8.64 v31.88,8.38
  Bottom 0.178: v31.88,8.38 28.62,8.38 27.86,7.62 J3.2
DRIVE_EN
  Top 0.178: U2.79 51.41,29.65 51.99,30.23 62.19,30.23 R15.2
DRIVE_ERR
  Top 0.178: U2.78 51.91,29.38 52.24,29.72 64.44,29.72 66.04,31.32 R16.2
EEPROM_SCL
  Top 0.178: U1.6 28.5,17.4 29.13,16.76 29.13,14.26 R3.1 29.17,13.17 29.64,12.7 35.99,12.7 36.24,12.95 36.24,13.72 37.26,14.73 39.2,14.73 U2.24
EEPROM_SDA
  Top 0.178: U2.25 37.86,14.32 37.26,13.72 37.26,12.19 36.75,11.68 27.61,11.68 27.31,11.98 R2.1 27.31,15.53 26.72,16.13 U1.5
ENCODER_A  (via drill 0.35)
  Top 0.178: U2.34 44.91,11.46 v44.12,10.67
  Bottom 0.178: v44.12,10.67 41.83,12.95 15.49,12.95 15.24,12.7 R18.2
ENCODER_B  (via drill 0.35)
  Top 0.178: U2.37 46.41,11.18 v45.89,10.67
  Bottom 0.178: v45.89,10.67 43.1,13.46 13.46,13.46 12.7,12.7 R19.2
ENCODER_Z  (via drill 0.35)
  Top 0.178: v47.16,10.67 46.91,10.92 U2.38
  Bottom 0.178: R20.2 10.16,12.7 11.43,13.97 46.48,13.97 47.16,13.29 v47.16,10.67
ETH_CRS  (via drill 0.35)
  Top 0.178: U2.92 44.91,31.16 v44.32,31.75
  Bottom 0.178: v44.32,31.75 45.59,33.02 47.75,33.02 48.18,33.45 J1.3
ETH_MDC
  Top 0.178: J1.4 50.72,33.83 49.91,33.02 48.01,33.02 47.41,32.42 U2.87
ETH_MDIO
  Top 0.178: J1.5 53.26,33.2 52.45,32.38 48.64,32.38 47.91,31.66 U2.86
ETH_RST  (via drill 0.35)
  Top 0.178: U2.44 49.91,11.05 v50.04,10.92 | v50.29,31.24 51.05,32 54.86,32 55.8,32.94 J1.6
  Bottom 0.178: v50.04,10.92 50.04,30.99 v50.29,31.24
ETH_RX_ER
  Top 0.178: U2.89 46.41,32.2 45.47,33.15 41.02,33.15 40.56,33.61 J2.6
ETH_RXD_0
  Top 0.178: U2.91 45.41,31.8 44.83,32.38 38.23,32.38 38.02,32.59 J2.5
ETH_RXD_1  (via drill 0.35)
  Top 0.178: v39.12,33.02 39.12,32.94 39.29,32.77 45.08,32.77 45.91,31.94 U2.90
  Bottom 0.178: v39.12,33.02 39.04,33.02 38.78,32.77 36.5,32.77 35.48,33.78 J2.4
ETH_TXD_0
  Top 0.178: U2.95 43.41,30.12 42.8,30.73 31.62,30.73 30.4,31.96 J2.2
ETH_TXD_1  (via drill 0.35)
  Top 0.178: U2.94 43.91,30.38 43.18,31.11 32.26,31.11 31.5,31.88 v31.5,33.15
  Bottom 0.178: J2.1 27.86,33.61 28.32,33.15 v31.5,33.15
ETH_TXD_EN
  Top 0.178: J2.3 32.94,31.96 33.4,31.5 43.31,31.5 44.41,30.39 U2.93
ETH_X1
  Top 0.178: J1.1 43.1,34.29 43.61,33.78 45.64,33.78 46.91,32.51 U2.88
FAN_1_PWM  (via drill 0.35)
  Top 0.178: U2.75 57.23,26.32 58.85,27.94 71.01,27.94 71.52,28.45 v71.52,29.72
  Bottom 0.178: v71.52,29.72 71.52,31.38 71.82,31.69 77.32,31.69 R21.2
FAN_1_SENSOR  (via drill 0.35)
  Top 0.178: U2.77 52.41,29.12 52.5,29.21 68.33,29.21 70.1,30.99 v73.91,30.99
  Bottom 0.178: R22.2 80.01,31.11 79.38,30.48 74.42,30.48 v73.91,30.99
FAN_2_PWM  (via drill 0.35)
  Top 0.178: U2.74 58,25.82 59.61,27.43 72.28,27.43 72.79,27.94 v72.79,29.72
  Bottom 0.178: R23.2 82.55,30.48 81.92,29.84 78.74,29.84 78.61,29.72 v72.79,29.72
FAN_2_SENSOR  (via drill 0.35)
  Top 0.178: U2.76 52.91,28.35 53.26,28.7 v70.1,28.7
  Bottom 0.178: v70.1,28.7 78.23,28.7 78.74,29.21 84.45,29.21 85.09,29.84 R24.2
GND  (via drill 0.5)
  Top 0.406: U4.4 61.31,19.99 v61.64,20.32
  other vias: 56.39,21.34 54.61,10.67
  pour Top: -10.24,45.72 106.6,45.72 106.6,-5.08 -10.24,-5.08
  pour Route2: -11.51,46.99 107.87,46.99 107.87,-6.35 -11.51,-6.35
  pour Bottom: -14.05,49.53 110.41,49.53 110.41,-8.89 -14.05,-8.89
HMI_BUTTON_1
  Bottom 0.178: J10.1 55.8,6.6 56.05,6.86 58.34,6.86 59.86,8.38 70.79,8.38 72.82,10.41 72.82,22.86 71.55,24.13 R33.1
HMI_BUTTON_2
  Bottom 0.178: J10.2 53.26,6.86 53.77,7.37 58.09,7.37 59.61,8.89 70.53,8.89 72.31,10.67 72.31,20.83 71.17,21.97 R34.1
HMI_BUTTON_3
  Bottom 0.178: J10.3 50.72,7.62 50.97,7.87 57.83,7.87 59.36,9.4 70.28,9.4 71.8,10.92 71.8,19.05 71.04,19.81 R35.1
HMI_BUTTON_4
  Bottom 0.178: J10.4 48.18,7.87 48.69,8.38 57.58,8.38 59.1,9.91 70.02,9.91 71.29,11.18 71.29,17.02 70.66,17.65 R36.1
HMI_BUTTON_5
  Bottom 0.178: J10.5 45.64,7.87 46.66,8.89 57.32,8.89 58.85,10.41 69.77,10.41 70.79,11.43 70.79,14.99 70.28,15.49 R37.1
HMI_BUTTON_6
  Bottom 0.178: J10.6 43.1,8.13 44.37,9.4 57.07,9.4 58.59,10.92 69.01,10.92 69.35,11.26 R38.1
HMI_BUTTON_CPU_1
  Top 0.178: U2.63 57.4,20.32 59,21.92 U4.1
HMI_BUTTON_CPU_2
  Top 0.178: U2.62 57.58,19.81 58.39,20.62 U4.3
HMI_BUTTON_CPU_3  (via drill 0.35)
  Top 0.178: U2.61 54.55,19.3 59.1,19.3 59.36,19.05 v60.88,19.05 | U4.6 65.25,20.62 v65.45,20.83
  Bottom 0.178: v65.45,20.83 62.91,20.83 62.4,20.32 62.4,19.56 61.9,19.05 v60.88,19.05
HMI_BUTTON_CPU_4
  Top 0.178: U2.60 58.57,18.82 59.28,18.11 U5.1
HMI_BUTTON_CPU_5
  Top 0.178: U2.59 58.31,18.32 58.85,17.78 58.85,17.02 59.05,16.82 U5.3
HMI_BUTTON_CPU_6
  Top 0.178: R4.2 R5.1 80.69,28.11 80.26,27.69 75.18,27.69 74.42,26.92 74.42,17.02 74.22,16.82 U5.6
HMI_BUTTON_MCU_FCT_6  (via drill 0.35)
  Top 0.178: U2.58 56.6,17.82 57.15,17.27 57.15,16 57.66,15.49 v59.94,15.49 | v66.29,14.73 66.55,14.48 70.61,14.48 72.13,16 75.18,16 75.44,16.26 75.44,25.91 v76.2,26.67 | v78.99,28.45 R5.2
  Bottom 0.178: v59.94,15.49 65.53,15.49 v66.29,14.73 | v76.2,26.67 77.22,26.67 v78.99,28.45
HMI_LCD_BACKLIGHT  (via drill 0.35)
  Top 0.178: U2.56 55.86,16.82 v56.31,17.27
  Bottom 0.178: R28.2 54.06,17.27 v56.31,17.27
HMI_LCD_LED+
  Bottom 0.178: T1.3 51.52,13.08 R26.2 51.1,10.21 50.8,9.91 43.94,9.91 42.67,8.64 41.15,8.64 40.56,8.05 J11.1
HMI_LCD_SCL
  Top 0.178: J11.2 38.02,7.11 38.27,7.37 51.48,7.37 52.41,8.29 U2.49
  Bottom 0.178: J11.2 37.93,5.17 R25.2 37.98,7.67 U3.3
HMI_LCD_SDA
  Top 0.178: J11.3 35.48,7.37 35.99,7.87 50.97,7.87 51.91,8.81 U2.48
  Bottom 0.178: U3.4 35.82,8.96 R27.2 35.82,5.42 J11.3
HMI_LCD_VO
  Bottom 0.178: U3.5 34.72,9.65 33.7,8.64 33.19,8.64 32.18,7.62 32.18,5.84 J11.4
HMI_LED_1  (via drill 0.35)
  Top 0.178: R39.1 65.88,10.49 64.69,11.68 60.37,11.68 v59.36,12.7 | U2.73 58.93,25.32 59.36,24.89 v59.36,23.62
  Bottom 0.178: v59.36,23.62 v59.36,12.7
HMI_LED_2  (via drill 0.35)
  Top 0.178: R40.2 63.34,10.24 62.91,10.67 59.61,10.67 v58.59,11.68 | U2.70 58.14,23.82 58.59,23.37 v58.59,22.61
  Bottom 0.178: v58.59,22.61 v58.59,11.68
HMI_LED_3  (via drill 0.35)
  Top 0.178: U2.69 57.63,23.32 57.83,23.11 v57.83,21.59 | v57.83,12.7 57.83,10.16 58.09,9.91 59.36,9.91 60.28,8.98 R41.1
  Bottom 0.178: v57.83,21.59 v57.83,12.7
HMI_LED_4  (via drill 0.35)
  Top 0.178: U2.68 56.86,22.82 v57.07,22.61 | R42.2 57.57,8.98 57.07,9.48 v57.07,11.68
  Bottom 0.178: v57.07,22.61 v57.07,11.68
ISP_RXDO  (via drill 0.5)
  Top 0.178: J12.4 9.48,25.99 9.02,25.53 J15.3 | U2.99 41.41,29.2 41.15,29.46 40.39,29.46 v39.62,28.7
  Bottom 0.178: v39.62,28.7 36.07,28.7 33.53,31.24 17.14,31.24 16.38,30.48 16.38,26.29 14.99,24.89 10.92,24.89 9.48,26.34 J12.4 9.48,26.08
ISP_TXDO  (via drill 0.5)
  Top 0.178: J12.5 12.02,25.73 11.18,24.89 10.67,24.89 10.41,24.64 10.41,20.45 10.16,20.19 9.4,20.19 9.02,19.81 J15.4 | U2.98 41.91,29.21 41.15,29.97 v39.12,29.97
  Bottom 0.178: J12.5 12.02,31.32 12.95,32.26 33.78,32.26 36.07,29.97 v39.12,29.97
JTAG_TCK  (via drill 0.35)
  Top 0.178: J15.8 14.1,15.62 14.61,15.11 17.78,15.11 18.29,15.62 18.29,19.18 20.07,20.95 20.07,25.27 v20.57,25.78 | v33.67,25.78 35.13,24.32 U2.5
  Bottom 0.178: v20.57,25.78 v33.67,25.78
JTAG_TDI  (via drill 0.35)
  Top 0.178: J15.7 14.1,20.83 14.73,20.19 17.27,20.19 18.03,20.95 18.03,27.69 v18.54,28.19 | U2.2 37.43,25.82 36.58,26.67 36.58,27.94 36.07,28.45 v32.51,28.45
  Bottom 0.178: v18.54,28.19 18.8,28.45 v32.51,28.45
JTAG_TDO  (via drill 0.35)
  Top 0.178: J15.9 16.64,24.77 17.02,25.15 17.02,28.19 v17.14,28.32 | U2.1 38.2,26.32 37.59,26.92 37.59,28.96 37.08,29.46 v31.75,29.46
  Bottom 0.178: v31.75,29.46 18.29,29.46 v17.14,28.32
JTAG_TMS  (via drill 0.35)
  Top 0.178: J15.10 16.64,19.56 16.76,19.68 18.03,19.68 19.05,20.7 19.05,26.92 v19.56,27.43 | U2.3 36.66,25.32 35.56,26.42 35.56,27.18 35.31,27.43 v33.27,27.43
  Bottom 0.178: v19.56,27.43 v33.27,27.43
LED_DEBUG  (via drill 0.35)
  Top 0.178: U2.35 45.41,14.28 v44.96,14.73 | LED1.A 7.1,2.81 v7.11,2.79
  Bottom 0.178: v44.96,14.73 10.92,14.73 7.11,10.92 v7.11,2.79
N$1
  Top 0.178: J14.2 63.34,5.16 R40.1
N$2
  Top 0.178: J14.4 58.26,5.16 R42.1
N$3
  Bottom 0.178: J7.1 15.16,7.96 R18.1
N$4
  Bottom 0.178: J7.2 12.62,7.96 R19.1
N$5
  Top 0.178: R7.1 R8.2 | R9.2 R8.2 | SW2.3 SW2.4 77.2,12.76 76.63,12.19 74.89,12.19 R8.2
N$6
  Bottom 0.178: J7.3 10.08,7.96 R20.1
N$7
  Bottom 0.178: T1.1 54.36,14.17 R28.1
N$8
  Bottom 0.178: R21.1 77.47,35.48 J8.1
N$9
  Bottom 0.178: R22.1 80.01,35.48 J8.2
N$10
  Bottom 0.178: R23.1 82.55,35.48 J8.3
N$11
  Bottom 0.178: R24.1 85.09,35.48 J8.4
N$12
  Top 0.178: J5.3 15.16,33.31 R13.1
N$13
  Top 0.178: R12.1 12.62,33.31 J5.2
N$14
  Top 0.178: R11.1 10.08,33.31 J5.1
N$15
  Top 0.178: J13.2 4.11,12.45 5.25,12.45 5.89,13.08 R30.1 R32.2
N$16
  Top 0.178: J13.3 4.87,11.81 5.76,10.92 R31.1
N$17  (via drill 0.35)
  Top 0.178: U4.7 65.15,21.29 65.45,21.59 65.45,23.88 v65.71,24.13 C14.1
  Bottom 0.178: v65.71,24.13 C14.1
N$18
  Top 0.178: LED2.C R29.1
N$19  (via drill 0.35)
  Top 0.178: U4.5 65.63,19.99 66.21,20.57 66.21,21.59 v66.47,21.84 66.59,21.97 C16.1
  Bottom 0.178: v66.47,21.84 66.59,21.97 C16.1
N$20  (via drill 0.35)
  Top 0.178: C18.1 v66.47,19.81 65.71,19.05 62.91,19.05 62.4,19.56 62.4,20.57 61.69,21.29 U4.2
  Bottom 0.178: v66.47,19.81 C18.1
N$21
  Top 0.178: R16.1 65.96,33.31 J6.4
N$22  (via drill 0.35)
  Top 0.178: v23.54,18.8 23.67,18.67 U1.7 27.69,18.67 R1.1 | JP1.1 1.7,19.56 v5.08,19.56
  Bottom 0.178: v23.54,18.8 23.03,18.29 6.86,18.29 5.59,19.56 v5.08,19.56
N$23
  Top 0.178: R15.1 63.42,33.31 J6.3
N$24
  Top 0.178: R14.1 60.88,33.31 J6.2
N$25  (via drill 0.35)
  Top 0.178: U5.7 66.5,17.48 v66.55,17.53 66.67,17.65 C15.1
  Bottom 0.178: 67.52,17.53 C15.1 66.67,17.65 v66.55,17.53
N$26  (via drill 0.35)
  Top 0.178: U5.5 66.04,16.18 v66.21,16 66.72,15.49 C17.1 67.4,15.75
  Bottom 0.178: 67.4,15.75 C17.1 66.72,15.49 v66.21,16
N$27  (via drill 0.35)
  Top 0.178: C19.1 v66.59,13.34 64.69,15.24 62.66,15.24 62.15,15.75 62.15,16.76 61.44,17.48 U5.2
  Bottom 0.178: v66.59,13.34 C19.1
N$28
  Top 0.178: R17.1 58.34,33.31 J6.1
N$29
  Top 0.178: R10.1 LED1.C
N$63
  Top 0.178: J14.1 65.88,5.16 R39.2
N$64
  Top 0.178: J14.3 60.8,5.16 R41.2
RTCX1
  Top 0.178: U2.16 37.31,18.82 36.58,19.56 36.58,20.57 36.32,20.83 34.21,20.83 X1.1 32.54,21.57 C5.1
RTCX2
  Top 0.178: U2.18 37.22,17.82 35.99,19.05 34.23,19.05 X1.2 32.54,19.07 C10.1
USB_D_N
  Top 0.178: R31.2 9.23,10.92 10.08,11.77 13.57,11.77 14.84,10.5 42.15,10.5 42.91,11.26 U2.30
USB_D_P
  Top 0.178: R30.2 9.1,13.08 10.08,12.1 13.7,12.1 14.97,10.83 41.76,10.83 42.41,11.48 U2.29
USB_UP_LED  (via drill 0.35, 0.5)
  Top 0.178: U2.32 43.91,11.48 v42.85,10.41 | v21.64,9.53 8,9.53 7.11,8.64 7.11,5.98 LED2.A
  Bottom 0.178: v42.85,10.41 40.81,12.45 24.56,12.45 v21.64,9.53
USB_V_BUS  (via drill 0.5)
  Top 0.305: J13.1 4.9,13.11 5.51,13.72 v5.51,13.97 | v37.26,16.51 37.45,16.32 U2.21
  Route15 0.406: v37.26,16.51 33.45,12.7 6.78,12.7 v5.51,13.97
VBAT+  (via drill 0.5)
  Top 0.305: U2.19 36.45,17.32 v36.24,17.53
  Route15 0.406: v85.09,10.92 85.09,22.23 | 85.09,22.23 85.09,26.16 v84.45,26.8 | 85.09,22.23 84.31,23 73,23 70,26 46.32,26 44.45,24.13 36.2,24.13 34.29,22.23 34.29,19.05 35.81,17.53 v36.24,17.53
  Bottom 0.406: X3.+2 81.76,26.54 84.2,26.54 v84.45,26.8 | X3.+1 81.78,10.79 84.96,10.79 v85.09,10.92
XTAL1
  Top 0.178: X2.3 35.01,16.48 35.23,16.26 35.99,16.26 36.42,15.82 U2.22

### Text on the board
Top: 1
Route2: 2
Route15: 3
Bottom: 4
tPlace: ADC | ETHERNET | FAN | RX | TX | RELAY | MCU Board / Rev A1 | RX | RST | TDI | TDO | +3V3 | GND | TX | TCK | TMS | LED | ENCODER | CAN | LCD | BUTTON | +5V | +3V3